# Altium project Digital_Clock.PrjPcb
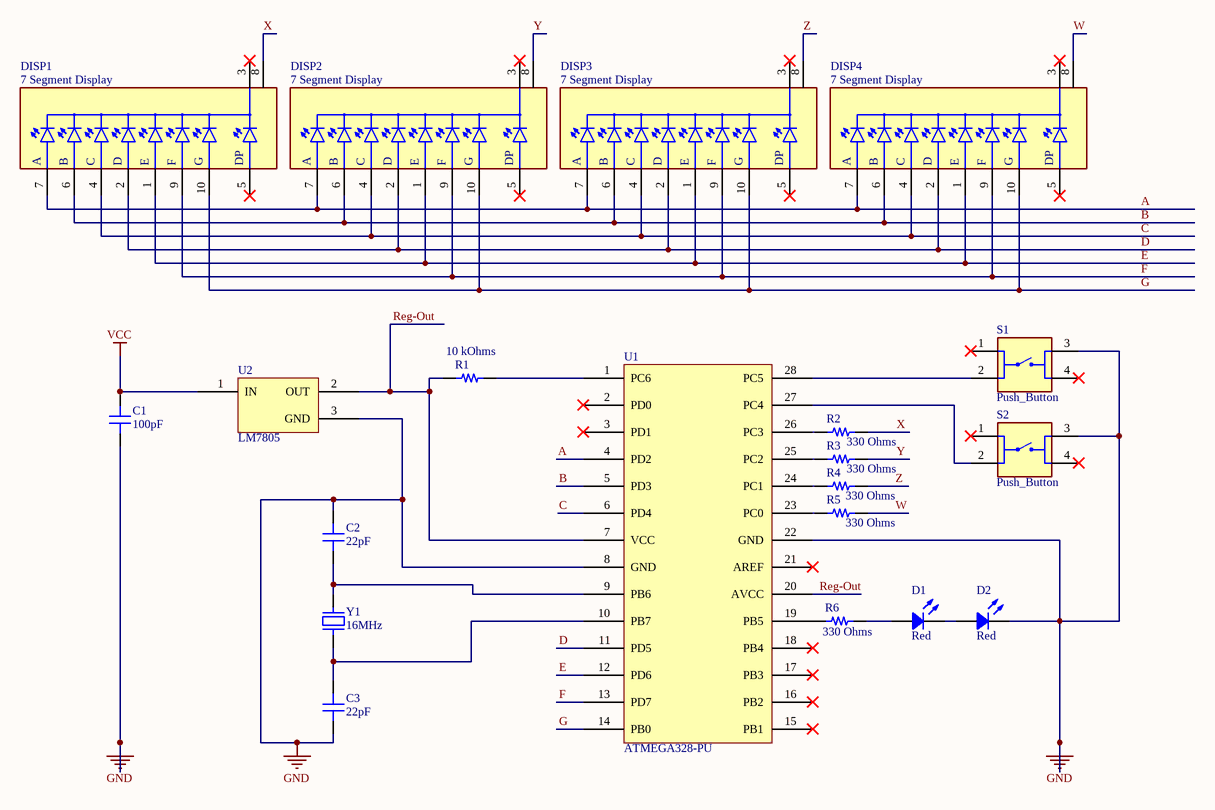
[diagram p0: Digital_Clock.SchDoc]
1 sheet, 20 parts. Net scope: global (net labels, ports and power ports of the same name join across sheets).
Board file: Digital_Clock.PcbDoc

## Sheet Digital_Clock.SchDoc
size A4; SheetNumber: 1; SheetTotal: 1

### Parts
C1  100pF  [CAP 0805_2012]
C2  22pF  [CAP 0805_2012]
C3  22pF  [CAP 0805_2012]
D1  Red  [LED 0805_2012 RED]
D2  Red  [LED 0805_2012 RED]
DISP1  7 Segment Display  [7 Segment Display]
DISP2  7 Segment Display  [7 Segment Display]
DISP3  7 Segment Display  [7 Segment Display]
DISP4  7 Segment Display  [7 Segment Display]
R1  10 kOhms  [YAGEO RES RK73 RS73 SG73 0805_2012]
R2  330 Ohms  [YAGEO RES RK73 RS73 SG73 0805_2012]
R3  330 Ohms  [YAGEO RES RK73 RS73 SG73 0805_2012]
R4  330 Ohms  [YAGEO RES RK73 RS73 SG73 0805_2012]
R5  330 Ohms  [YAGEO RES RK73 RS73 SG73 0805_2012]
R6  330 Ohms  [YAGEO RES RK73 RS73 SG73 0805_2012]
S1  Push_Button  [Push_Button]
S2  Push_Button  [Push_Button]
U1  ATMEGA328-PU  [ATMEGA328-PU]
U2  LM7805  [LM7805CT]
Y1  16MHz  [ABRACON ABLS]

### Nets
GND: C1.1 C2.2 C3.1 D2.2 S1.3 S2.3 U1.8(GND) U1.22(GND) U2.3(GND)
VCC: C1.2 U2.1(IN)
A: DISP1.7(A) DISP2.7(A) DISP3.7(A) DISP4.7(A) U1.4(PD2)
B: DISP1.6(B) DISP2.6(B) DISP3.6(B) DISP4.6(B) U1.5(PD3)
C: DISP1.4(C) DISP2.4(C) DISP3.4(C) DISP4.4(C) U1.6(PD4)
D: DISP1.2(D) DISP2.2(D) DISP3.2(D) DISP4.2(D) U1.11(PD5)
E: DISP1.1(E) DISP2.1(E) DISP3.1(E) DISP4.1(E) U1.12(PD6)
F: DISP1.9(F) DISP2.9(F) DISP3.9(F) DISP4.9(F) U1.13(PD7)
G: DISP1.10(G) DISP2.10(G) DISP3.10(G) DISP4.10(G) U1.14(PB0)
Reg-Out: R1.1 U1.7(VCC) U1.20(AVCC) U2.2(OUT)
W: DISP4.8(COM) R5.2
X: DISP1.8(COM) R2.2
Y: DISP2.8(COM) R3.2
Z: DISP3.8(COM) R4.2
NetC2_1: C2.1 U1.9(PB6) Y1.2
NetC3_2: C3.2 U1.10(PB7) Y1.1
NetD1_1: D1.1 D2.1
NetD1_2: D1.2 R6.2
NetR1_2: R1.2 U1.1(PC6)
NetR2_1: R2.1 U1.26(PC3)
NetR3_1: R3.1 U1.25(PC2)
NetR4_1: R4.1 U1.24(PC1)
NetR5_1: R5.1 U1.23(PC0)
NetR6_1: R6.1 U1.19(PB5)
NetS1_2: S1.2 U1.28(PC5)
NetS2_2: S2.2 U1.27(PC4)

Not connected (* = marked no-connect by the designer): DISP1 3(COM)* 5(DP)*; DISP2 3(COM)* 5(DP)*; DISP3 3(COM)* 5(DP)*; DISP4 3(COM)* 5(DP)*; S1 1* 4*; S2 1* 4*; U1 2(PD0)* 3(PD1)* 15(PB1)* 16(PB2)* 17(PB3)* 18(PB4)* 21(AREF)*

### Library data of the parts
C1 = 08053A101J4T2A: CAP CER 100PF 25V NP0 0805; manufacturer: AVX Corporation; Temperature Coefficient: C0G, NP0; Tolerance: ±5%; Part Number: 08053A101J4T2A; Capacitance: 100pF; Applications: Automotive; componentlink1description: Datasheet; componentlink1url: http://datasheets.avx.com/AutoMLCC.pdf; componentlink2description: DigiKey Link; componentlink2url: http://digikey.com/product-detail/en/avx-corporation/08053A101J4T2A/478-08053A101J4T2ACT-ND/11570400; Device Package: 0805 (2012 Metric); lastupdated: 2.09.2020 01:04:04; Lifecycle Status: Active; Minimum Order: 1; Mounting Type: Surface Mount, MLCC; Operating Temperature: -55°C ~ 125°C; Package / Case: 0805 (2012 Metric); packaging: TapeAndReel; partid: 27788; Part Status: Active; price: 0.03; Ratings: AEC-Q200; series: -; Supplier 1: DigiKey; Supplier Part Number 1: 478-08053A101J4T2ACT-ND; value: 100pF; Voltage - Rated: 25V
C2 C3 = 08055C220JAT2A: CAP CER 22PF 50V X7R 0805; manufacturer: AVX Corporation; Tolerance: ±5%; Part Number: 08055C220JAT2A; Capacitance: 22pF; Applications: General Purpose; componentlink1description: Datasheet; componentlink1url: http://datasheets.avx.com/X7RDielectric.pdf; componentlink2description: DigiKey Link; componentlink2url: http://digikey.com/product-detail/en/avx-corporation/08055C220JAT2A/478-08055C220JAT2ACT-ND/11570372; Device Package: 0805 (2012 Metric); lastupdated: 2.09.2020 01:04:04; Lifecycle Status: Active; Minimum Order: 1; Mounting Type: Surface Mount, MLCC; Operating Temperature: -55°C ~ 125°C; Package / Case: 0805 (2012 Metric); packaging: TapeAndReel; partid: 27776; Part Status: Active; price: 0.05; series: -; Supplier 1: DigiKey; Supplier Part Number 1: 478-08055C220JAT2ACT-ND; Temperature Coefficient: X7R; value: 22pF; Voltage - Rated: 50V
D1 D2 = XZCM2CRK54WA-1VF: LED RED CLEAR 0805 SMD; Manufacturer: SunLED; Current - Test: 2mA; Lens Color: Colorless; Lens Size: 1.30mm x 1.25mm; Lens Style: Rectangle with Flat Top; Millicandela Rating: 98mcd; Viewing Angle: 140°; Voltage - Forward (Vf) (Typ): 1.8V; Wavelength - Dominant: 625nm; Wavelength - Peak: 640nm; Part Number: XZCM2CRK54WA-1VF; Color: Red; ComponentLink1Description: Datasheet; ComponentLink1URL: https://www.sunledusa.com/products/spec/XZCM2CRK54WA-1VF.pdf; ComponentLink2Description: DigiKey Link; ComponentLink2URL: https://www.digikey.com/en/products/detail/sunled/XZCM2CRK54WA-1VF/15761904; Device Package: 0805 (2012 Metric); Height (Max): 0.85mm; LastUpdated: 3.06.2024 20:00:05; Lens Transparency: Clear; Lifecycle Status: Active; Minimum Order: 1; Mounting Type: Surface Mount; Package / Case: 0805 (2012 Metric); Packaging: TapeAndReel; PartId: 1021; Part Status: Active; Price: 0.12; Series: -; Size / Dimension: 2.00mm L x 1.25mm W; Supplier 1: DigiKey; Supplier Part Number 1: 1497-XZCM2CRK54WA-1VFCT-ND; Supplier Device Package: 0805; Value: Red
R1 = SG73P2ATTD1002F: RES 10K OHM 1% 1/2W 0805; Manufacturer: KOA Speer Electronics, Inc.; Power (Watts): 0.5W, 1/2W; Temperature Coefficient: ±100ppm/°C; Part Number: SG73P2ATTD1002F; Value: 10 kOhms; ComponentLink1Description: Datasheet; ComponentLink1URL: https://www.koaspeer.com/pdfs/SG73P.pdf; ComponentLink2Description: DigiKey Link; ComponentLink2URL: https://www.digikey.com/en/products/detail/koa-speer-electronics-inc/SG73P2ATTD1002F/10188413; Composition: Thick Film; Device Package: 0805 (2012 Metric); Features: Automotive AEC-Q200, Pulse Withstanding; Height - Seated (Max): 0.024" (0.60mm); LastUpdated: 25.07.2024 09:45:15; Lifecycle Status: Active; Minimum Order: 1; Number of Terminations: 2; Operating Temperature: -55°C ~ 155°C; Package / Case: 0805 (2012 Metric); Packaging: TapeAndReel; PartId: 60912; Part Status: Active; Price: 0.02; Ratings: AEC-Q200; Resistance: 10 kOhms; Series: SG73P; Size / Dimension: 0.079" L x 0.049" W (2.00mm x 1.25mm); Supplier 1: DigiKey; Supplier Part Number 1: 2019-SG73P2ATTD1002FCT-ND; Supplier Device Package: 0805; Tolerance: ±1%
R2-R6 = SG73P2ATTD3300F: RES 330 OHM 1% 1/2W 0805; Manufacturer: KOA Speer Electronics, Inc.; Power (Watts): 0.5W, 1/2W; Temperature Coefficient: ±100ppm/°C; Part Number: SG73P2ATTD3300F; Value: 330 Ohms; ComponentLink1Description: Datasheet; ComponentLink1URL: https://www.koaspeer.com/pdfs/SG73P.pdf; ComponentLink2Description: DigiKey Link; ComponentLink2URL: https://www.digikey.com/en/products/detail/koa-speer-electronics-inc/SG73P2ATTD3300F/10188071; Composition: Thick Film; Device Package: 0805 (2012 Metric); Features: Automotive AEC-Q200, Pulse Withstanding; Height - Seated (Max): 0.024" (0.60mm); LastUpdated: 25.07.2024 09:45:15; Lifecycle Status: Active; Minimum Order: 1; Number of Terminations: 2; Operating Temperature: -55°C ~ 155°C; Package / Case: 0805 (2012 Metric); Packaging: TapeAndReel; PartId: 60891; Part Status: Active; Price: 0.02; Ratings: AEC-Q200; Resistance: 330 Ohms; Series: SG73P; Size / Dimension: 0.079" L x 0.049" W (2.00mm x 1.25mm); Supplier 1: DigiKey; Supplier Part Number 1: 2019-SG73P2ATTD3300FCT-ND; Supplier Device Package: 0805; Tolerance: ±1%
Y1 = ABLS-16.000MHZ-20-D4H-T: CRYSTAL 16.0000MHZ 20PF SMD; Manufacturer: Abracon LLC; ESR (Equivalent Series Resistance): 40 Ohms; Frequency Stability: ±35ppm; Frequency Tolerance: ±30ppm; Operating Mode: Fundamental; Part Number: ABLS-16.000MHZ-20-D4H-T; ComponentLink1Description: Datasheet; ComponentLink1URL: https://abracon.com/Resonators/abls.pdf; ComponentLink2Description: DigiKey Link; ComponentLink2URL: http://digikey.com/product-detail/en/abracon-llc/ABLS-16.000MHZ-20-D4H-T/535-14857-1-ND/9997934; Frequency: 16MHz; Height - Seated (Max): 0.165" (4.20mm); LastUpdated: 3.06.2024 20:02:00; Lifecycle Status: Active; Load Capacitance: 20pF; Minimum Order: 0; Mounting Type: Surface Mount; Operating Temperature: -40°C ~ 85°C; Package / Case: HC-49/US; Packaging: TapeAndReel; PartId: 171; Part Status: Active; Price: 0.39; Series: ABLS; Size / Dimension: 0.449" L x 0.185" W (11.40mm x 4.70mm); Supplier 1: DigiKey; Supplier Part Number 1: 535-14857-1-ND; Type: MHz Crystal; Value: 16MHz